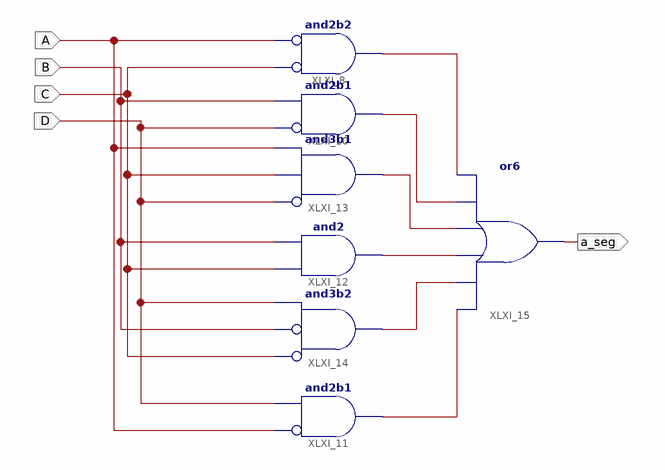
[diagram p0: schematic sheet 1]
// Xilinx ISE schematic bcd4to7a.sch (spartan6) as structural Verilog: 7 symbols, 5 ports
module bcd4to7a (
  input  A,
  input  B,
  input  C,
  input  D,
  output a_seg
);

  wire XLXN_1, XLXN_2, XLXN_3, XLXN_4, XLXN_5, XLXN_6;

  and XLXI_8 (XLXN_1, ~C, ~A);  // and2b2
  and XLXI_10 (XLXN_2, ~D, B);  // and2b1
  and XLXI_11 (XLXN_6, ~A, D);  // and2b1
  and XLXI_12 (XLXN_4, C, B);
  and XLXI_13 (XLXN_3, ~D, C, A);  // and3b1
  and XLXI_14 (XLXN_5, ~C, ~B, D);  // and3b2
  or XLXI_15 (a_seg, XLXN_6, XLXN_5, XLXN_4, XLXN_3, XLXN_2, XLXN_1);
endmodule
